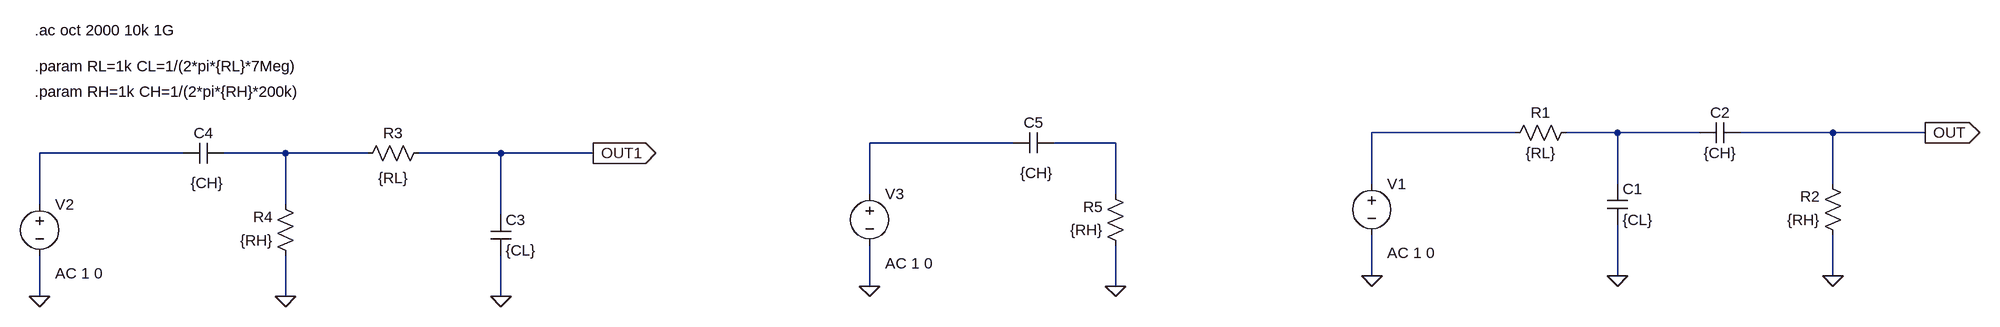
[diagram p0: schematic Report4.asc]
Report4.asc, the LTspice schematic file:
Version 4
SHEET 1 2892 724
WIRE 2144 112 1920 112
WIRE 2304 112 2224 112
WIRE 2432 112 2304 112
WIRE 2640 112 2496 112
WIRE 2784 112 2640 112
WIRE 1360 128 1136 128
WIRE 1520 128 1424 128
WIRE 64 144 -160 144
WIRE 224 144 128 144
WIRE 352 144 224 144
WIRE 560 144 432 144
WIRE 704 144 560 144
WIRE 1920 192 1920 112
WIRE 2304 192 2304 112
WIRE 2640 192 2640 112
WIRE 1136 208 1136 128
WIRE 1520 208 1520 128
WIRE -160 224 -160 144
WIRE 224 224 224 144
WIRE 560 240 560 144
WIRE 1920 336 1920 272
WIRE 2304 336 2304 256
WIRE 2640 336 2640 272
WIRE 1136 352 1136 288
WIRE 1520 352 1520 288
WIRE -160 368 -160 304
WIRE 224 368 224 304
WIRE 560 368 560 304
FLAG 1920 336 0
FLAG 2304 336 0
FLAG 2640 336 0
FLAG 2784 112 OUT
IOPIN 2784 112 Out
FLAG -160 368 0
FLAG 224 368 0
FLAG 560 368 0
FLAG 704 144 OUT1
IOPIN 704 144 Out
FLAG 1136 352 0
FLAG 1520 352 0
SYMBOL res 2240 96 R90
WINDOW 0 0 56 VBottom 2
WINDOW 3 32 56 VTop 2
SYMATTR InstName R1
SYMATTR Value {RL}
SYMBOL res 2656 288 R180
WINDOW 0 36 76 Left 2
WINDOW 3 36 40 Left 2
SYMATTR InstName R2
SYMATTR Value {RH}
SYMBOL cap 2288 192 R0
SYMATTR InstName C1
SYMATTR Value {CL}
SYMBOL cap 2496 96 R90
WINDOW 0 0 32 VBottom 2
WINDOW 3 32 32 VTop 2
SYMATTR InstName C2
SYMATTR Value {CH}
SYMBOL voltage 1920 176 R0
WINDOW 123 24 124 Left 2
WINDOW 39 0 0 Left 0
SYMATTR Value2 AC 1 0
SYMATTR InstName V1
SYMATTR Value ""
SYMBOL res 448 128 R90
WINDOW 0 0 56 VBottom 2
WINDOW 3 39 56 VTop 2
SYMATTR InstName R3
SYMATTR Value {RL}
SYMBOL res 240 320 R180
WINDOW 0 36 76 Left 2
WINDOW 3 36 40 Left 2
SYMATTR InstName R4
SYMATTR Value {RH}
SYMBOL cap 544 240 R0
SYMATTR InstName C3
SYMATTR Value {CL}
SYMBOL cap 128 128 R90
WINDOW 0 0 32 VBottom 2
WINDOW 3 47 27 VTop 2
SYMATTR InstName C4
SYMATTR Value {CH}
SYMBOL voltage -160 208 R0
WINDOW 123 24 124 Left 2
WINDOW 39 0 0 Left 0
SYMATTR Value2 AC 1 0
SYMATTR InstName V2
SYMATTR Value ""
SYMBOL res 1536 304 R180
WINDOW 0 36 76 Left 2
WINDOW 3 36 40 Left 2
SYMATTR InstName R5
SYMATTR Value {RH}
SYMBOL cap 1424 112 R90
WINDOW 0 0 32 VBottom 2
WINDOW 3 47 27 VTop 2
SYMATTR InstName C5
SYMATTR Value {CH}
SYMBOL voltage 1136 192 R0
WINDOW 123 24 124 Left 2
WINDOW 39 0 0 Left 0
SYMATTR Value2 AC 1 0
SYMATTR InstName V3
SYMATTR Value ""
TEXT -168 -48 Left 2 !.ac oct 2000 10k 1G
TEXT -168 8 Left 2 !.param RL=1k CL=1/(2*pi*{RL}*7Meg)
TEXT -168 48 Left 2 !.param RH=1k CH=1/(2*pi*{RH}*200k)

The netlist it stands for:
* Report4.asc
R1 N002 N001 {RL}
R2 0 OUT {RH}
C1 N002 0 {CL}
C2 OUT N002 {CH}
V1 N001 0 AC 1 0
R3 OUT1 N006 {RL}
R4 0 N006 {RH}
C3 OUT1 0 {CL}
C4 N006 N005 {CH}
V2 N005 0 AC 1 0
R5 0 N004 {RH}
C5 N004 N003 {CH}
V3 N003 0 AC 1 0
.ac oct 2000 10k 1G
.param RL=1k CL=1/(2*pi*{RL}*7Meg)
.param RH=1k CH=1/(2*pi*{RH}*200k)
.backanno
.end